# Altium schematic sheet jarvis_mini.SchDoc: JARVAS Tag
size A3; Organization: Stanford University; Address1: EE 285 Final Project; Address2: D. Dutz, Q. Nguyen; Address3: T. Teisberg, E. Wu, A. Zeng; Address4: Drawn by T. Teisberg; Revision: 3; SheetNumber: 1; SheetTotal: 1
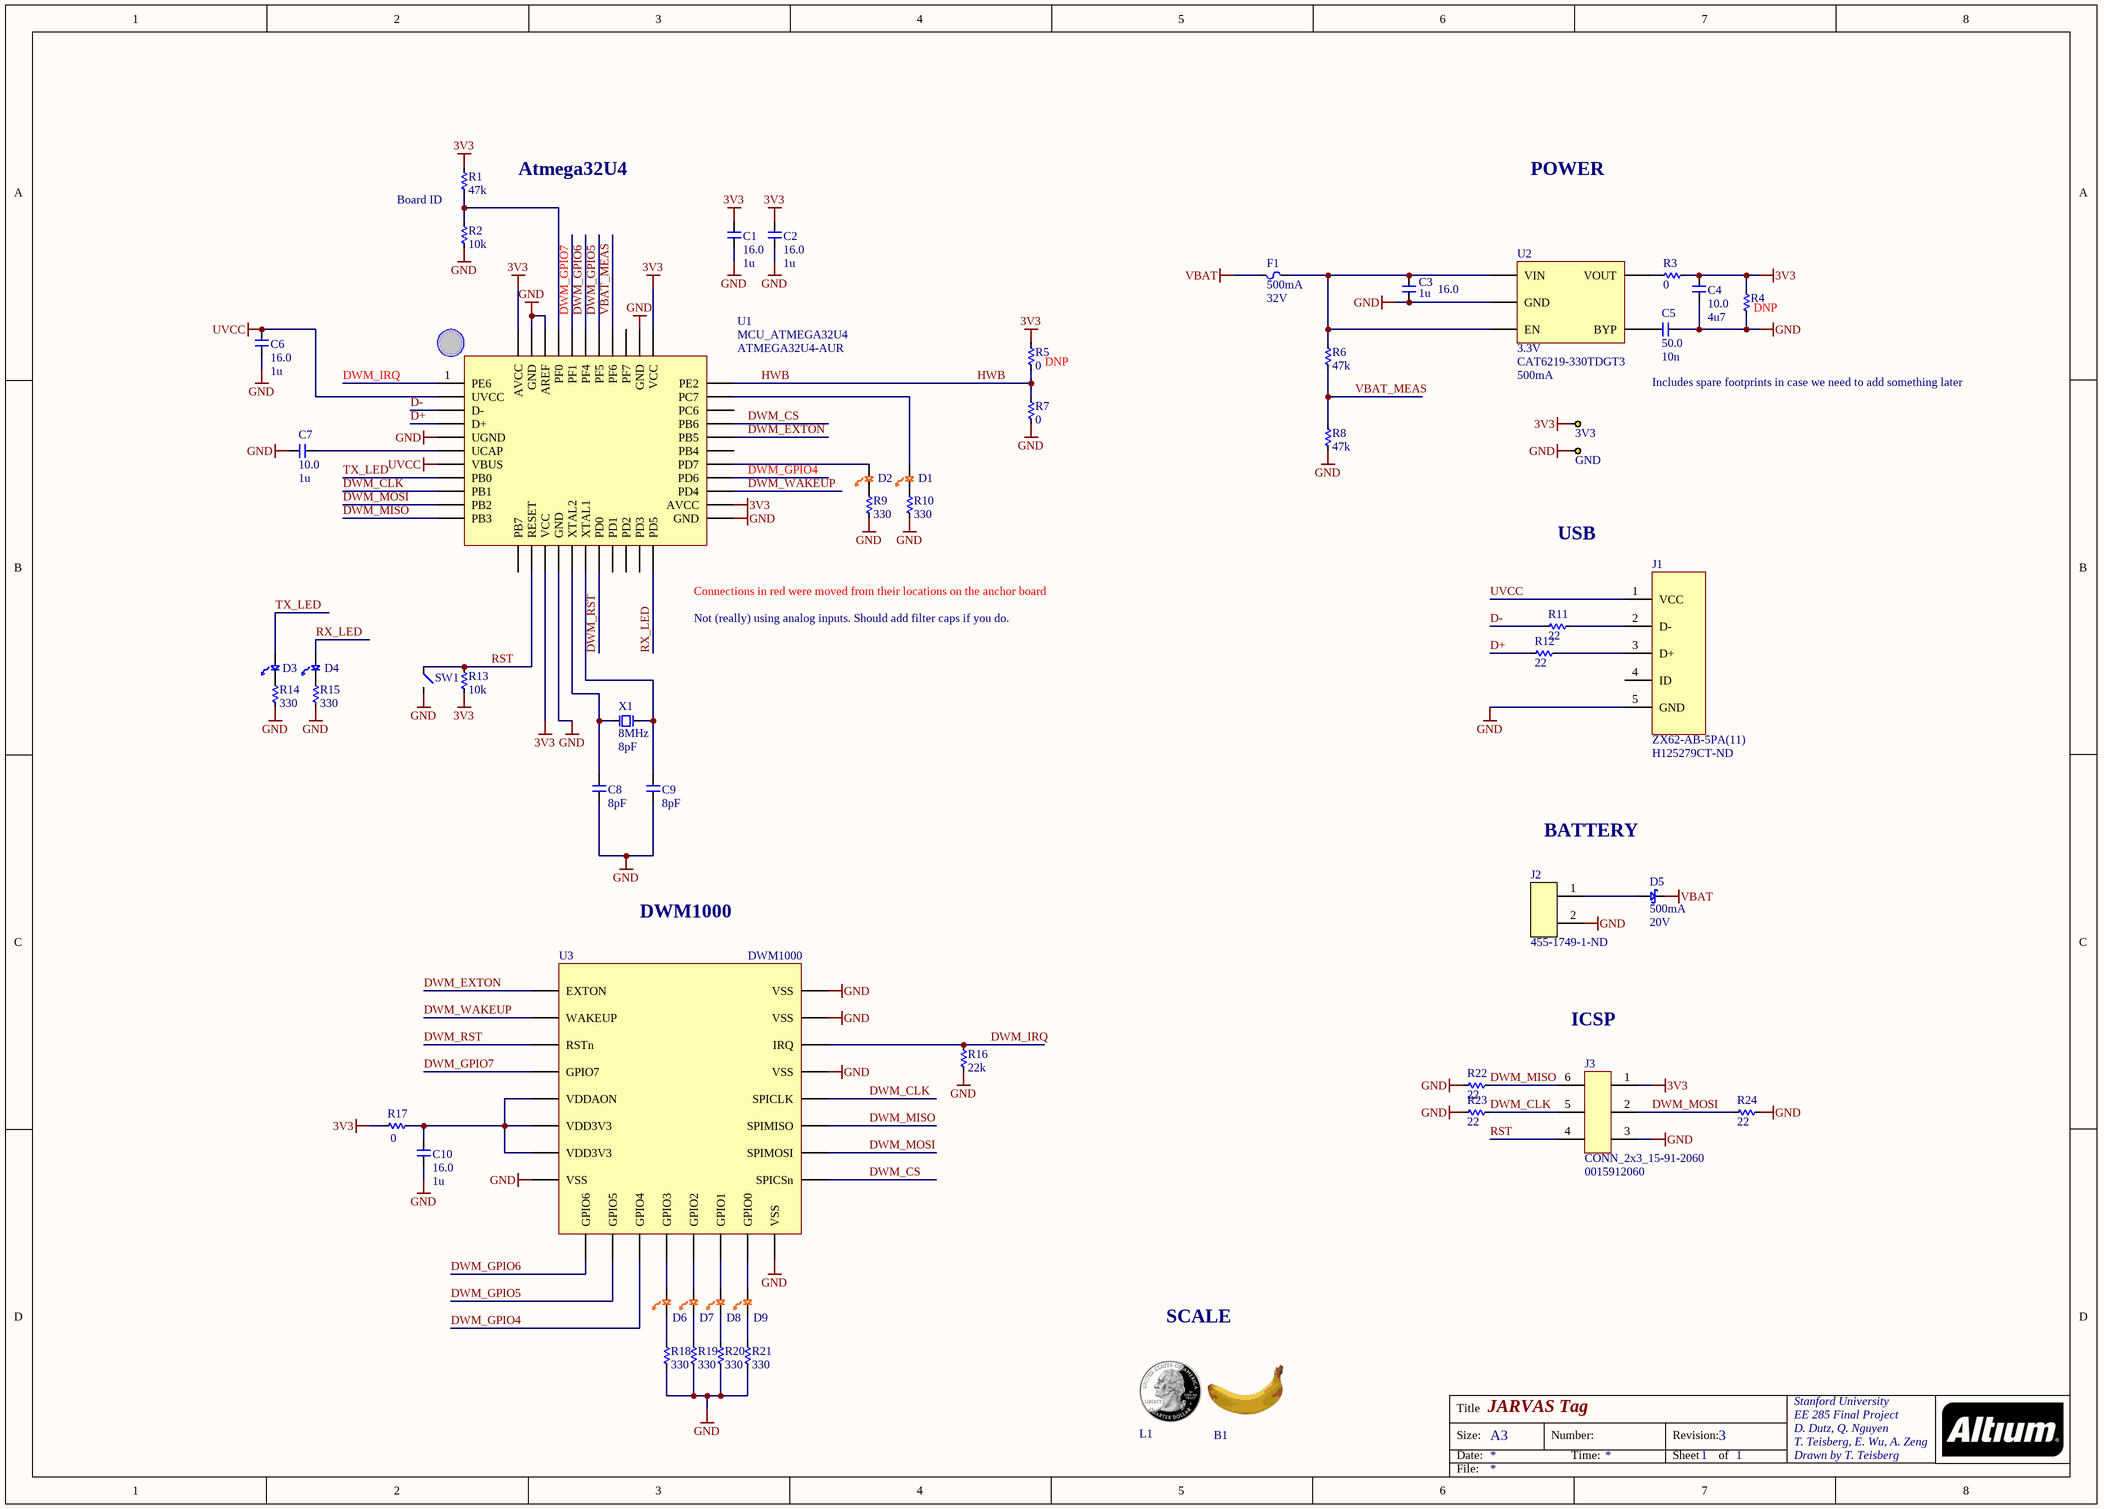
[diagram p0: jarvis_mini.SchDoc]

## Parts
3V3  TEST_KEYSTONE5015  [TP_KEYSTONE_5015]  (value not drawn)
B1  Banananannaa!  [BANANA_OPEN]  (value not drawn)
C1  voltage: 16.0  human_value: 1u  [C0603]  (hidden comment: __template_cap)
C2  voltage: 16.0  human_value: 1u  [C0603]  (hidden comment: __template_cap)
C3  voltage: 16.0  human_value: 1u  [C0603]  (hidden comment: __template_cap)
C4  voltage: 10.0  human_value: 4u7  [C0603]  (hidden comment: __template_cap)
C5  voltage: 50.0  human_value: 10n  [C0603]  (hidden comment: __template_cap)
C6  voltage: 16.0  human_value: 1u  [C0603]  (hidden comment: __template_cap)
C7  voltage: 10.0  human_value: 1u  [C0603]  (hidden comment: __template_cap)
C8  Capacitance: 8pF  [C0603]  (hidden comment: CAP_CER_8PF_100V)
C9  Capacitance: 8pF  [C0603]  (hidden comment: CAP_CER_8PF_100V)
C10  voltage: 16.0  human_value: 1u  [C0603]  (hidden comment: __template_cap)
D1  LED  [LED_0603P_ORANGE]  (value not drawn)
D2  LED  [LED_0603P_ORANGE]  (value not drawn)
D3  LED_LBQ39G_BLUE  [LED_0603P_BLUE]  (value not drawn)
D4  LED_LBQ39G_BLUE  [LED_0603P_BLUE]  (value not drawn)
D5  Current - Average Rectified (Io): 500mA  Voltage - DC Reverse (Vr) (Max): 20V  [SOD123]  (hidden comment: SCHOTTKY_MBR0520L)
D6  LED  [LED0603]  (value not drawn)
D7  LED  [LED0603]  (value not drawn)
D8  LED  [LED0603]  (value not drawn)
D9  LED  [LED0603]  (value not drawn)
F1  Current Rating: 500mA  Voltage Rating - DC: 32V  [R0805]  (hidden comment: FAST_MFU0805.50CT-ND)
GND  TEST_KEYSTONE5015  [TP_KEYSTONE_5015]  (value not drawn)
J1  Manufacturer Part Number: ZX62-AB-5PA(11)  Supplier Part Number 1: H125279CT-ND  [HIROSE_ZX62-AB-5PA]  (hidden comment: CONN_USB_MICROAB_SMD_R/A)
J2  Supplier Part Number 1: 455-1749-1-ND  [CONN_JST_PH_SM4_2PIN_RA]  (hidden comment: CONN JST 2POS SMD)
J3  CONN_2x3_15-91-2060  Manufacturer Part Number: 0015912060  [MOLEX_15-91-2060]
L1  QUARTER  [Quarter]  (value not drawn)
R1  value 47k  [R0603]  (hidden comment: __template_resistor)
R2  value 10k  [R0603]  (hidden comment: __template_resistor)
R3  value 0  [R0603]  (hidden comment: __template_resistor)
R4  __template_resistor  [R0603]  (value not drawn)
R5  value 0  [R0603]  (hidden comment: __template_resistor)
R6  value 47k  [R0603]  (hidden comment: __template_resistor)
R7  value 0  [R0603]  (hidden comment: __template_resistor)
R8  value 47k  [R0603]  (hidden comment: __template_resistor)
R9  value 330  [R0603]  (hidden comment: __template_resistor)
R10  value 330  [R0603]  (hidden comment: __template_resistor)
R11  value 22  [R0603]  (hidden comment: __template_resistor)
R12  value 22  [R0603]  (hidden comment: __template_resistor)
R13  value 10k  [R0603]  (hidden comment: __template_resistor)
R14  value 330  [R0603]  (hidden comment: __template_resistor)
R15  value 330  [R0603]  (hidden comment: __template_resistor)
R16  value 22k  [R0603]  (hidden comment: __template_resistor)
R17  Resistance (Machine readable): 0  [R0603]  (hidden comment: __template_resistor)
R18  value 330  [R0603]  (hidden comment: __template_resistor)
R19  value 330  [R0603]  (hidden comment: __template_resistor)
R20  value 330  [R0603]  (hidden comment: __template_resistor)
R21  value 330  [R0603]  (hidden comment: __template_resistor)
R22  value 22  [R0603]  (hidden comment: __template_resistor)
R23  value 22  [R0603]  (hidden comment: __template_resistor)
R24  value 22  [R0603]  (hidden comment: __template_resistor)
SW1  SWITCH_SPST-NO  [SWITCH_B3U-1000P]  (value not drawn)
U1  MCU_ATMEGA32U4  Manufacturer Part Number: ATMEGA32U4-AUR  [44TQFP10]
U2  Voltage - Output: 3.3V  Manufacturer Part Number: CAT6219-330TDGT3  Current - Output: 500mA  [TSOT-23-5]  (hidden comment: 3.3V LDO)
U3  DWM1000  [DW1000]
X1  Frequency: 8MHz  Load Capacitance: 8pF  [XTAL_NDK_NX5032]  (hidden comment: XTAL_NX5032GA)

## Nets
3V3: 3V3.1 C1.1 C2.1 C4.2 J3.1 R1.2 R3.2 R4.2 R5.2 R13.1 R17.1 U1.14(VCC) U1.24(AVCC) U1.34(VCC) U1.44(AVCC)
GND: C1.2 C2.2 C3.1 C4.1 C5.2 C6.2 C7.1 C8.2 C9.2 C10.2 GND.1 J1.5(GND) J2.2 J3.3 R2.1 R4.1 R7.1 R8.1 R9.1 R10.1 R14.1 R15.1 R16.1 R18.1 R19.1 R20.1 R21.1 R22.1 R23.1 R24.2 SW1.2 U1.5(UGND) U1.15(GND) U1.23(GND) U1.35(GND) U1.42(AREF) U1.43(GND) U2.2(GND) U3.8(VSS) U3.16(VSS) U3.21(VSS) U3.23(VSS) U3.24(VSS)
UVCC: C6.1 J1.1(VCC) U1.2(UVCC) U1.7(VBUS)
VBAT: D5.2 F1.1
D+: R12.1 U1.4(D+)
D-: R11.1 U1.3(D-)
DWM_CLK: J3.5 R23.2 U1.9(PB1) U3.20(SPICLK)
DWM_CS: U1.30(PB6) U3.17(SPICSn)
DWM_EXTON: U1.29(PB5) U3.1(EXTON)
DWM_GPIO4: U1.26(PD6) U3.11(GPIO4)
DWM_GPIO5: U1.38(PF5) U3.10(GPIO5)
DWM_GPIO6: U1.39(PF4) U3.9(GPIO6)
DWM_GPIO7: U1.40(PF1) U3.4(GPIO7)
DWM_IRQ: R16.2 U1.1(PE6) U3.22(IRQ)
DWM_MISO: J3.6 R22.2 U1.11(PB3) U3.19(SPIMISO)
DWM_MOSI: J3.2 R24.1 U1.10(PB2) U3.18(SPIMOSI)
DWM_RST: U1.18(PD0) U3.3(RSTn)
DWM_WAKEUP: U1.25(PD4) U3.2(WAKEUP)
HWB: R5.1 R7.2 U1.33(PE2)
RST: J3.4 R13.2 SW1.1 U1.13(RESET)
RX_LED: D4.2 U1.22(PD5)
TX_LED: D3.2 U1.8(PB0)
VBAT_MEAS: R6.1 R8.2 U1.37(PF6)
NetC3_2: C3.2 F1.2 R6.2 U2.1(VIN) U2.3(EN)
NetC5_1: C5.1 U2.4(BYP)
NetC7_2: C7.2 U1.6(UCAP)
NetC8_1: C8.1 U1.16(XTAL2) X1.2
NetC9_1: C9.1 U1.17(XTAL1) X1.1
NetC10_1: C10.1 R17.2 U3.5(VDDAON) U3.6(VDD3V3) U3.7(VDD3V3)
NetD1_A: D1.A U1.32(PC7)
NetD1_K: D1.K R10.2
NetD2_A: D2.A U1.27(PD7)
NetD2_K: D2.K R9.2
NetD3_1: D3.1 R14.2
NetD4_1: D4.1 R15.2
NetD5_1: D5.1 J2.1
NetD6_A: D6.A U3.12(GPIO3)
NetD6_K: D6.K R18.2
NetD7_A: D7.A U3.13(GPIO2)
NetD7_K: D7.K R19.2
NetD8_A: D8.A U3.14(GPIO1)
NetD8_K: D8.K R20.2
NetD9_A: D9.A U3.15(GPIO0)
NetD9_K: D9.K R21.2
NetJ1_2: J1.2(D-) R11.2
NetJ1_3: J1.3(D+) R12.2
NetR1_1: R1.1 R2.2 U1.41(PF0)
NetR3_1: R3.1 U2.5(VOUT)

Not connected (* = marked no-connect by the designer): J1 4(ID); U1 12(PB7) 19(PD1) 20(PD2) 21(PD3) 28(PB4) 31(PC6) 36(PF7)

## Notes on the sheet
- Atmega32U4
- POWER
- Board ID
- Includes spare footprints in case we need to add something later
- USB
- Not (really) using analog inputs. Should add filter caps if you do.
- (near U1) Connections in red were moved from their locations on the anchor board
- BATTERY
- DWM1000
- ICSP
- SCALE
- Title
- Size:
- Date:
- A3
- Number:
- Time:
- Revision:
- Sheet
- of
- File:

## Library data of the parts
3V3 GND = TEST_KEYSTONE5015: PC TEST POINT MINIATURE SMT; Manufacturer: Keystone Electronics; Manufacturer Part Number: 5015; Supplier 1: Digi-Key; RoHS: RoHS Compliant; Category: Test and Measurement; Stock 1: 1322985; Pricing 1: 1=0.44, 10=0.413, 50=0.301, 100=0.2891, 250=0.25964, 500=0.24784 (USD); Type: PC Test Point, Miniature; Terminal: 0.010" (0.25mm) Phosphor Bronze, Silver Plate; Mounting Type: Surface Mount; Material: Phosphor Bronze; Color: -; Packaging: Cut Tape (CT); ComponentLink1URL: http://mail.keyelco.com/ENG._DEPT/PDF%20CAT%20NO%20Drawings/5015.pdf; ComponentLink1Description: Datasheet; Supplier Part Number 1: 5015KCT-ND
B1 = BANANA: Banana for scale; Manufacturer: Dole; Manufacturer Part Number: B-0000001; Potassium Content: Lots!; Plug/Mating Plug Diameter: Standard Banana; Insulation: Peel; Body Material: Cellulose; Supplier 1: Amazon; RoHS: RoHS Compliant; Category: Fruit; Pricing 1: 1=1.38 (USD); Packaging: Bunch; Part Status: Active; Color: Yellow; Operating Temperature: 13°C ~ 40°C; ComponentLink1URL: http://botanical.pbrc.edu/pdf/Banana.pdf; ComponentLink1Description: Datasheet; Supplier Part Number 1: B000NOGLY2; ComponentLink2URL: https://www.amazon.com/produce-aisle-mburring-Bananas-bunch/dp/B000NOGLY2/ref=sr_1_1_a_f_it?ie=UTF8&qid=1476226309&sr=8-1&ppw=fresh&keywords=banana; ComponentLink2Description: Supplier Link
C1-C3 C6 C10 = 587-1251-1-ND: type: capacitor; value: 1e-06; tolerance: 10%; Supplier Part Number 1: 587-1251-1-ND; package: 0603; price: 0.125
C4 = 587-1441-1-ND: type: capacitor; value: 4.7e-06; tolerance: 10%; Supplier Part Number 1: 587-1441-1-ND; package: 0603; price: 0.285
C5 = 399-1092-1-ND: type: capacitor; value: 1e-08; tolerance: 5%; Supplier Part Number 1: 399-1092-1-ND; package: 0603; price: 0.075
C7 = 478-1251-1-ND: type: capacitor; value: 1e-06; tolerance: 10%; Supplier Part Number 1: 478-1251-1-ND; package: 0603; price: 0.138
C8 C9 = CAP_CER_8PF_100V: Manufacturer: AVX Corporation; Manufacturer Part Number: 06031A8R0CAT2A; Tolerance: ±0.25pF; Voltage - Rated: 100V; Temperature Coefficient: C0G, NP0; Supplier 1: Digi-Key; RoHS: RoHS Compliant; Category: Capacitors; Stock 1: 6262; Pricing 1: 1=0.22, 10=0.151, 25=0.1108, 50=0.0908, 100=0.0766, 250=0.06248, 500=0.05242, 1000=0.04637 (USD); Packaging: Cut Tape (CT); Part Status: Active; Operating Temperature: -55°C ~ 125°C; Features: -; Ratings: -; Applications: General Purpose; Failure Rate: *; Mounting Type: Surface Mount, MLCC; Package / Case: 0603 (1608 Metric); Size / Dimension: 0.063" L x 0.032" W (1.60mm x 0.81mm); Height - Seated (Max): -; Thickness (Max): 0.035" (0.90mm); Lead Spacing: -; Lead Style: -; ComponentLink1URL: http://datasheets.avx.com/C0GNP0-Dielectric.pdf; ComponentLink1Description: http://datasheets.avx.com/C0GNP0-Dielectric.pdf; Supplier Part Number 1: 478-3697-1-ND
D1 D2 = LED_LTST-C190KFKT_ORANGE: Orange 605nm LED Indication - Discrete 2V 0603 (1608 Metric); pin to pad: A>2 K>1; Manufacturer: Lite-On Inc.; Lens Color: Colorless; Lens Transparency: Clear; Millicandela Rating: 90mcd; Lens Style/Size: Rectangle with Flat Top, 1.10mm x 0.80mm; Current - Test: 20mA; Viewing Angle: 130°; Wavelength - Peak: 611nm; Supplier 1: Digi-Key; Manufacturer Part Number: LTST-C190KFKT; RoHS: RoHS Compliant; Category: Optoelectronics; Stock 1: 237550; Pricing 1: 1=0.25, 10=0.183, 25=0.1348, 100=0.0963, 250=0.06544, 500=0.05776, 1000=0.04524 (USD); Packaging: Cut Tape (CT); Part Status: Active; Color: Orange; Voltage - Forward (Vf) (Typ): 2V; Mounting Type: Surface Mount; Wavelength - Dominant: 605nm; Features: -; Package / Case: 0603 (1608 Metric); Supplier Device Package: *; Size / Dimension: 1.60mm L x 0.80mm W; Height (Max): 0.80mm; ComponentLink1URL: http://optoelectronics.liteon.com/upload/download/DS-22-99-0186/S_110_LTST-C190KFKT.pdf; ComponentLink1Description: http://optoelectronics.liteon.com/upload/download/DS-22-99-0186/S_110_LTST-C190KFKT.pdf; Supplier Part Number 1: 160-1434-1-ND
D3 D4 = LED_LBQ39G_BLUE: Blue 470nm LED Indication - Discrete 2.85V 0603 (1608 Metric); Manufacturer: OSRAM Opto Semiconductors Inc.; Manufacturer Part Number: LB Q39G-L2OO-35-1; Lens Color: White; Lens Transparency: Diffused; Millicandela Rating: 29.5mcd; Lens Style/Size: Rectangle with Flat Top, 1.10mm x 0.80mm; Current - Test: 5mA; Viewing Angle: 155°, 135°; Wavelength - Peak: 472nm; Supplier 1: Digi-Key; RoHS: RoHS Compliant; Category: Optoelectronics; Stock 1: 57960; Pricing 1: 1=0.35, 10=0.25, 25=0.2172, 100=0.167, 250=0.13568, 500=0.10018, 1000=0.08349 (USD); Packaging: Cut Tape (CT); Color: Blue; Voltage - Forward (Vf) (Typ): 2.85V; Mounting Type: Surface Mount; Wavelength - Dominant: 470nm; Features: -; Package / Case: 0603 (1608 Metric); Supplier Device Package: *; Size / Dimension: 1.60mm L x 0.80mm W; Height (Max): 0.40mm; ComponentLink1URL: http://media.digikey.com/pdf/Data%20Sheets/Osram%20PDFs/LB_LT%20Q39G.pdf; ComponentLink1Description: http://media.digikey.com/pdf/Data%20Sheets/Osram%20PDFs/LB_LT%20Q39G.pdf; Supplier Part Number 1: 475-2816-1-ND
D5 = SCHOTTKY_MBR0520L: DIODE SCHOTTKY 0.5A 20V SOD-123; Manufacturer: Fairchild Semiconductor; Speed: Fast Recovery =< 500ns, > 200mA (Io); Current - Reverse Leakage @ Vr: 250µA @ 20V; Voltage - Forward (Vf) (Max) @ If: 385mV @ 500mA; Supplier 1: Digi-Key; Manufacturer Part Number: MBR0520L; RoHS: RoHS Compliant; Category: Discrete Semiconductor Products; Stock 1: 217232; Pricing 1: 1=0.63, 10=0.43, 100=0.2024, 250=0.1442, 500=0.11006, 750=0.08603, 1000=0.0759 (USD); Diode Type: Schottky; Reverse Recovery Time (trr): -; Capacitance @ Vr, F: -; Mounting Type: Surface Mount; Package / Case: SOD-123; Supplier Device Package: SOD-123; Packaging: Cut Tape (CT); ComponentLink1URL: http://www.fairchildsemi.com/ds/MB/MBR0520L.pdf; ComponentLink1Description: Datasheet; Supplier Part Number 1: MBR0520LCT-ND
D6-D9 = LED_LTST-C190KFKT_ORANGE: Orange 605nm LED Indication - Discrete 2V 0603 (1608 Metric); Manufacturer: Lite-On Inc.; Lens Color: Colorless; Lens Transparency: Clear; Millicandela Rating: 90mcd; Lens Style/Size: Rectangle with Flat Top, 1.10mm x 0.80mm; Current - Test: 20mA; Viewing Angle: 130°; Wavelength - Peak: 611nm; Supplier 1: Digi-Key; Manufacturer Part Number: LTST-C190KFKT; RoHS: RoHS Compliant; Category: Optoelectronics; Stock 1: 237550; Pricing 1: 1=0.25, 10=0.183, 25=0.1348, 100=0.0963, 250=0.06544, 500=0.05776, 1000=0.04524 (USD); Packaging: Cut Tape (CT); Part Status: Active; Color: Orange; Voltage - Forward (Vf) (Typ): 2V; Mounting Type: Surface Mount; Wavelength - Dominant: 605nm; Features: -; Package / Case: 0603 (1608 Metric); Supplier Device Package: *; Size / Dimension: 1.60mm L x 0.80mm W; Height (Max): 0.80mm; ComponentLink1URL: http://optoelectronics.liteon.com/upload/download/DS-22-99-0186/S_110_LTST-C190KFKT.pdf; ComponentLink1Description: http://optoelectronics.liteon.com/upload/download/DS-22-99-0186/S_110_LTST-C190KFKT.pdf; Supplier Part Number 1: 160-1434-1-ND
F1 = FAST_MFU0805.50CT-ND: FUSE .50A 0805 VFAST SMD; Manufacturer: Vishay Beyschlag; Manufacturer Part Number: MFU0805FF00500P100; Fuse Type: Board Mount (Cartridge Style Excluded); Response Time: Fast; Breaking Capacity @ Rated Voltage: 50A; Melting I²t: 0.0009; Approvals: UL; DC Cold Resistance: 0.57 Ohm; Supplier 1: Digi-Key; RoHS: RoHS Compliant; Category: Circuit Protection; Stock 1: 17651; Pricing 1: 1=0.62, 10=0.528, 100=0.431, 500=0.3518 (USD); Voltage Rating - AC: -; Package / Case: 0805 (2012 Metric); Mounting Type: Surface Mount; Size / Dimension: 0.079" L x 0.049" W x 0.022" H (2.00mm x 1.25mm x 0.55mm); Operating Temperature: -55°C ~ 125°C; Color: -; Packaging: *; ComponentLink1URL: http://www.vishay.com/doc?28747; ComponentLink1Description: Datasheet; Supplier Part Number 1: MFU0805.50DKR-ND
J1 = CONN_USB_MICROAB_SMD_R/A: CONN RCPT MICRO USB AB SMD R/A; Manufacturer: Hirose Electric Co Ltd; Connector Type: USB - micro AB; Number of Contacts: 5; Gender: Receptacle; Specifications: USB 2.0; RoHS: RoHS Compliant; Category: Connectors, Interconnects; Packaging: Cut Tape (CT); Mounting Type: Surface Mount, Right Angle, Horizontal; Features: -; Ingress Protection: -; ComponentLink1URL: http://www.hirose.co.jp/cataloge_hp/e24200011.pdf; ComponentLink1Description: Datasheet; Supplier 1: Digi-Key
J2 = CONN_JST_2_PH: CONN HEADER PH SIDE 2POS 2MM SMD; Manufacturer: JST Sales America Inc.; Manufacturer Part Number: S2B-PH-SM4-TB(LF)(SN); Connector Type: Header, Shrouded; Number of Positions: 2; Number of Positions Loaded: All; Pitch: 0.079" (2.00mm); Supplier 1: Digi-Key; RoHS: RoHS Compliant; Category: Connectors, Interconnects; Stock 1: 148568; Pricing 1: 1=0.56, 10=0.521, 25=0.4688, 50=0.4168, 100=0.3994, 250=0.36472, 500=0.34734 (USD); Packaging: Cut Tape (CT); Contact Type: Male Pin; Number of Rows: 1; Row Spacing: -; Contact Mating Length: 0.130" (3.30mm); Mounting Type: Surface Mount, Right Angle; Termination: Solder; Fastening Type: Detent Lock; Features: Solder Retention; Contact Finish: Tin; Contact Finish Thickness: -; Color: Natural; ComponentLink1URL: http://www.jst-mfg.com/product/pdf/eng/ePH.pdf; ComponentLink1Description: http://www.jst-mfg.com/product/pdf/eng/ePH.pdf
J3 = CONN_2x3_15-91-2060: CONN HEADER 6POS .100" VERT TIN; Manufacturer: Molex Inc; Connector Type: Header, Unshrouded, Breakaway; Number of Positions: 6; Number of Positions Loaded: All; Pitch: 0.100" (2.54mm); Supplier 1: Digi-Key; RoHS: RoHS Compliant; Category: Connectors, Interconnects; Stock 1: 5665; Pricing 1: 1=0.43, 10=0.4, 50=0.32, 100=0.3066, 250=0.27992, 500=0.2666, 1000=0.21995, 2500=0.19995, 5000=0.19329 (USD); Contact Type: Male Pin; Number of Rows: 2; Row Spacing: 0.100" (2.54mm); Contact Mating Length: 0.240" (6.10mm); Mounting Type: Surface Mount; Termination: Solder; Fastening Type: -; Features: -; Contact Finish: Tin; Contact Finish Thickness: 150µin (3.81µm); Color: Black; Packaging: Bulk; ComponentLink1URL: http://www.molex.com/pdm_docs/sd/015912060_sd.pdf; ComponentLink1Description: http://www.molex.com/pdm_docs/sd/015912060_sd.pdf; Supplier Part Number 1: WM17449-ND
L1 = QUARTER: Quarter for scale
R1 R6 R8 = CRCW060347K0FKEA: RES SMD 47K OHM 1% 1/10W 0603; Manufacturer: Vishay Dale; Resistance (Machine readable): 47000; Unit Price (USD): 0.081; Power (Watts): 0.1W, 1/10W; Supplier Part Number: 541-47.0KHCT-ND; Manufacturer Part Number: CRCW060347K0FKEA; type: resistor; Packaging: Cut Tape (CT); Series: CRCW; Tolerance: ±1%; Package: 0603 (1608 Metric)
R2 R13 = CRCW060310K0FKEA: RES SMD 10K OHM 1% 1/10W 0603; Manufacturer: Vishay Dale; Resistance (Machine readable): 10000; Unit Price (USD): 0.081; Power (Watts): 0.1W, 1/10W; Supplier Part Number: 541-10.0KHCT-ND; Manufacturer Part Number: CRCW060310K0FKEA; type: resistor; Packaging: Cut Tape (CT); Series: CRCW; Tolerance: ±1%; Package: 0603 (1608 Metric)
R3 R5 R7 = CRCW06030000Z0EA: RES SMD 0.0 OHM; Manufacturer: Vishay Dale; Unit Price (USD): 0.081; Tolerance: ±1%; Power (Watts): 0.1W, 1/10W; Supplier Part Number: 541-0.0GCT-ND; Manufacturer Part Number: CRCW06030000Z0EA; Resistance (Machine readable): 0; type: resistor; Packaging: Cut Tape (CT); Series: CRCW; Package: 0603 (1608 Metric)
  R5: DNP: DNP
R4 = CRCW06030000Z0EA: RES SMD 0.0 OHM; Manufacturer: Vishay Dale; Value: 0; Unit Price (USD): 0.081; Tolerance: ±1%; Power (Watts): 0.1W, 1/10W; Supplier Part Number: 541-0.0GCT-ND; Manufacturer Part Number: CRCW06030000Z0EA; Resistance (Machine readable): 0; type: resistor; Packaging: Cut Tape (CT); Series: CRCW; Package: 0603 (1608 Metric); DNP: DNP
R9 R10 R14 R15 R18-R21 = CRCW0603330RFKEA: RES SMD 330 OHM 1% 1/10W 0603; Manufacturer: Vishay Dale; Unit Price (USD): 0.081; Power (Watts): 0.1W, 1/10W; Supplier Part Number: 541-330HCT-ND; Manufacturer Part Number: CRCW0603330RFKEA; Resistance (Machine readable): 330; type: resistor; Packaging: Cut Tape (CT); Series: CRCW; Tolerance: ±1%; Package: 0603 (1608 Metric)
R11 R12 R22-R24 = CRCW060322R0FKEA: RES SMD 22 OHM 1% 1/10W 0603; Manufacturer: Vishay Dale; Unit Price (USD): 0.081; Power (Watts): 0.1W, 1/10W; Supplier Part Number: 541-22.0HCT-ND; Manufacturer Part Number: CRCW060322R0FKEA; Resistance (Machine readable): 22; type: resistor; Packaging: Cut Tape (CT); Series: CRCW; Tolerance: ±1%; Package: 0603 (1608 Metric)
R16 = CRCW060322K0FKEA: RES SMD 22K OHM 1% 1/10W 0603; Manufacturer: Vishay Dale; Resistance (Machine readable): 22000; Unit Price (USD): 0.081; Power (Watts): 0.1W, 1/10W; Supplier Part Number: 541-22.0KHCT-ND; Manufacturer Part Number: CRCW060322K0FKEA; type: resistor; Packaging: Cut Tape (CT); Series: CRCW; Tolerance: ±1%; Package: 0603 (1608 Metric)
R17 = CRCW06030000Z0EA: RES SMD 0.0 OHM; Manufacturer: Vishay Dale; Value: 1; Unit Price (USD): 0.081; Tolerance: ±1%; Power (Watts): 0.1W, 1/10W; Supplier Part Number: 541-0.0GCT-ND; Manufacturer Part Number: CRCW06030000Z0EA; type: resistor; Packaging: Cut Tape (CT); Series: CRCW; Package: 0603 (1608 Metric)
SW1 = SWITCH_SPST-NO: SWITCH TACTILE SPST-NO 0.05A 12V; Manufacturer: Omron Electronics Inc-EMC Div; Manufacturer Part Number: B3U-1000P; Switch Function: Off-Mom; Actuator Type: Standard; Actuator Height off PCB, from Pins: 1.60mm; Actuator Orientation: Top Actuated; Outline: 3.00mm x 2.50mm; Illumination: Non-Illuminated; Operating Force: 153gf; Ingress Protection: Dust Proof; Switch Travel: 0.15mm; Mechanical Life: 200,000 Cycles; Contact Rating @ Voltage: 0.05A @ 12VDC; Supplier 1: Digi-Key; RoHS: RoHS Compliant; Category: Switches; Stock 1: 16437; Pricing 1: 1=1.25, 10=1.201, 25=1.1332, 50=0.997, 100=0.9064, 250=0.86108, 500=0.83842, 1000=0.65714 (USD); Circuit: SPST-NO; Mounting Type: Surface Mount; Termination Style: SMD (SMT) Tab; Illumination Voltage (Nominal): -; Illumination Type, Color: -; Features: -; Packaging: Cut Tape (CT); Actuator Material: -; Operating Temperature: -25°C ~ 70°C; ComponentLink1URL: http://components.omron.com/components/web/pdflib.nsf/0/2DD3893C7DD33E9E862572900079E9D6/$file/B3U_1110.pdf; ComponentLink1Description: http://components.omron.com/components/web/pdflib.nsf/0/2DD3893C7DD33E9E862572900079E9D6/$file/B3U_1110.pdf; Supplier Part Number 1: SW1020CT-ND
U1 = MCU_ATMEGA32U4: IC MCU 8BIT 32KB FLASH 44TQFP; Manufacturer: Atmel; Core Processor: AVR; Core Size: 8-Bit; Speed: 16MHz; Connectivity: I²C, SPI, UART/USART, USB; Peripherals: Brown-out Detect/Reset, POR, PWM, WDT; Number of I/O: 26; Program Memory Size: 32KB (16K x 16); EEPROM Size: 1K x 8; RAM Size: 2.5K x 8; Voltage - Supply (Vcc/Vdd): 2.7 V ~ 5.5 V; Data Converters: A/D 12x10b; Oscillator Type: Internal; Supplier 1: Digi-Key; RoHS: RoHS Compliant; Category: Integrated Circuits (ICs); Stock 1: 7155; Pricing 1: 1=6.5, 10=5.846, 25=5.3264, 100=4.8069, 250=4.41712, 500=4.02736 (USD); Packaging: Cut Tape (CT); Program Memory Type: FLASH; Operating Temperature: -40°C ~ 85°C; Package / Case: 44-TQFP; Supplier Device Package: 44-TQFP (10x10); ComponentLink1URL: http://media.digikey.com/pdf/Data%20Sheets/Atmel%20PDFs/ATmega16U4,32U4.pdf; ComponentLink1Description: Datasheet; Supplier Part Number 1: ATMEGA32U4-AURCT-ND
U2 = LDO_CAT6219_3V3: Linear Voltage Regulator IC Positive Fixed 1 Output 3.3V 500mA TSOT-23-5; Manufacturer: ON Semiconductor; Voltage - Dropout (Typical): 0.3V @ 500mA; Number of Regulators: 1; Voltage - Input: Up to 5.5V; Supplier 1: Digi-Key; RoHS: RoHS Compliant; Category: Integrated Circuits (ICs); Stock 1: 7748; Pricing 1: 1=0.92, 10=0.821, 100=0.6399, 500=0.5292, 1000=0.4185 (USD); Packaging: Cut Tape (CT); Part Status: Active; Regulator Topology: Positive Fixed; Current - Limit (Min): -; Operating Temperature: -40°C ~ 125°C; Mounting Type: Surface Mount; Package / Case: SOT-23-5 Thin, TSOT-23-5; Supplier Device Package: TSOT-23-5; ComponentLink1URL: http://www.onsemi.com/pub_link/Collateral/CAT6219-D.PDF; ComponentLink1Description: http://www.onsemi.com/pub_link/Collateral/CAT6219-D.PDF; Supplier Part Number 1: CAT6219-330TDGT3CT-ND
U3 = DWM1000: Manufacturer: Decawave Limited; Protocol: IR-UWB; Modulation: BPM, BPSK; Frequency: 3.5GHz ~ 6.5GHz; Data Rate: 6.8Mbps; Serial Interfaces: SPI; Antenna Type: Integrated, Chip; Voltage - Supply: 2.8 V ~ 3.6 V; Current - Receiving: 64mA; Current - Transmitting: 31mA; Supplier 1: Digi-Key; Manufacturer Part Number: DWM1000; RoHS: RoHS Compliant; Category: RF/IF and RFID; Stock 1: 8794; Pricing 1: 1=25.59, 10=23.625, 25=21.6564, 100=20.0156, 250=19.03124 (USD); Packaging: Cut Tape (CT); Part Status: Active; RF Family/Standard: 802.15.4; Power - Output: -; Sensitivity: -; Memory Size: -; Mounting Type: Surface Mount; Operating Temperature: -40°C ~ 85°C; Package / Case: Module; ComponentLink1URL: http://www.decawave.com/sites/default/files/resources/dwm1000-datasheet-v1.4.pdf; ComponentLink1Description: http://www.decawave.com/sites/default/files/resources/dwm1000-datasheet-v1.4.pdf; Supplier Part Number 1: 1479-1002-1-ND
X1 = XTAL_NX5032GA: CRYSTAL 8.00 MHZ 8PF SMD; Manufacturer: NDK; Manufacturer Part Number: NX5032GA 8MHZ AT-W; Frequency Stability: ±150ppm; Frequency Tolerance: ±50ppm; Operating Mode: Fundamental; Supplier 1: Digi-Key; RoHS: RoHS Compliant; Category: Crystals and Oscillators; Stock 1: 22492; Pricing 1: 1=1.7, 10=1.474, 50=1.2928, 100=1.0206, 500=0.86184 (USD); Type: MHz Crystal; Operating Temperature: -40°C ~ 150°C; Mounting Type: Surface Mount; Package / Case: 2-SMD; Size / Dimension: 0.197" L x 0.126" W (5.00mm x 3.20mm); Height: 0.059" (1.50mm); Packaging: Cut Tape (CT); ComponentLink1URL: http://www.ndk.com/images/products/catalog/c_NX5032GA-STD-CSU-2_e.pdf; ComponentLink1Description: Datasheet; Supplier Part Number 1: 644-1132-1-ND